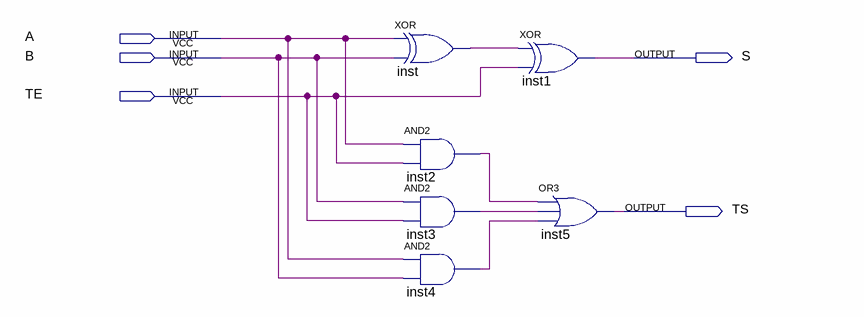
[diagram p0: schematic sheet]
// Quartus schematic som_compl.bdf as structural Verilog: 6 symbols, 5 pins
module som_compl (
  input  A,
  input  B,
  input  TE,
  output S,
  output TS
);

  wire inst2_out, inst3_out, inst4_out, inst_out;

  xor inst (inst_out, A, B);
  and inst2 (inst2_out, A, TE);
  and inst3 (inst3_out, B, TE);
  and inst4 (inst4_out, A, B);
  xor inst1 (S, inst_out, TE);
  or inst5 (TS, inst2_out, inst3_out, inst4_out);
endmodule
